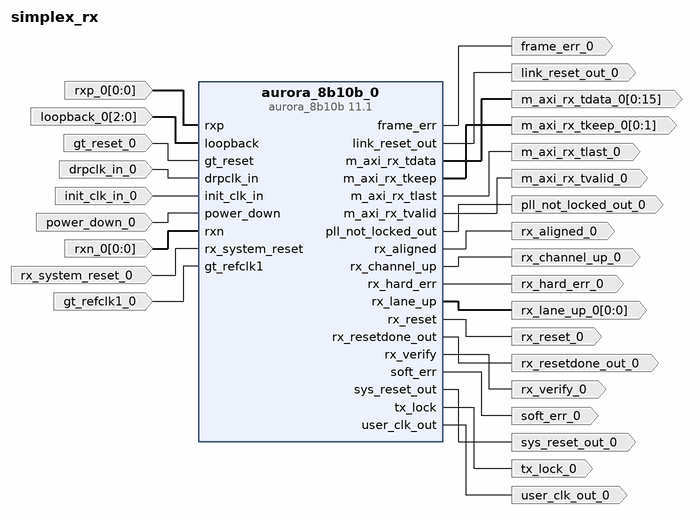
[diagram p0: block diagram of the top level]
# Vivado block design simplex_rx, xc7z045ffg900-2, Vivado 2018.3
create_bd_design simplex_rx

create_bd_port -dir I -from 0 -to 0 rxp_0
create_bd_port -dir I -from 2 -to 0 loopback_0
create_bd_port -dir I -type rst gt_reset_0
set_property -dict {CONFIG.POLARITY ACTIVE_HIGH} [get_bd_ports gt_reset_0]
create_bd_port -dir I -type clk drpclk_in_0
create_bd_port -dir I -type clk init_clk_in_0
create_bd_port -dir I -type rst power_down_0
create_bd_port -dir I -from 0 -to 0 rxn_0
create_bd_port -dir I -type rst rx_system_reset_0
set_property -dict {CONFIG.POLARITY ACTIVE_HIGH} [get_bd_ports rx_system_reset_0]
create_bd_port -dir I -type clk gt_refclk1_0
set_property -dict {CONFIG.FREQ_HZ 125000000} [get_bd_ports gt_refclk1_0]
create_bd_port -dir O -from 0 -to 1 m_axi_rx_tkeep_0
create_bd_port -dir O m_axi_rx_tlast_0
create_bd_port -dir O -from 0 -to 15 m_axi_rx_tdata_0
create_bd_port -dir O m_axi_rx_tvalid_0
create_bd_port -dir O rx_aligned_0
create_bd_port -dir O rx_reset_0
create_bd_port -dir O rx_verify_0
create_bd_port -dir O soft_err_0
create_bd_port -dir O rx_channel_up_0
create_bd_port -dir O rx_hard_err_0
create_bd_port -dir O -from 0 -to 0 rx_lane_up_0
create_bd_port -dir O rx_resetdone_out_0
create_bd_port -dir O frame_err_0
create_bd_port -dir O pll_not_locked_out_0
create_bd_port -dir O tx_lock_0
create_bd_port -dir O -type clk user_clk_out_0
set_property -dict {CONFIG.FREQ_HZ 156250000} [get_bd_ports user_clk_out_0]
create_bd_port -dir O -type rst link_reset_out_0
create_bd_port -dir O -type rst sys_reset_out_0

create_bd_cell -type ip -vlnv xilinx.com:ip:aurora_8b10b:11.1 aurora_8b10b_0
set_property -dict [list \
  CONFIG.C_DRP_IF false \
  CONFIG.Dataflow_Config RX-only_Simplex \
  CONFIG.SINGLEEND_GTREFCLK true \
  CONFIG.SINGLEEND_INITCLK true \
  CONFIG.SupportLevel 1 \
] [get_bd_cells aurora_8b10b_0]

# ---- connections ----

connect_bd_net -net rxp_0_1 [get_bd_ports rxp_0] [get_bd_pins aurora_8b10b_0/rxp]
connect_bd_net -net loopback_0_1 [get_bd_ports loopback_0] [get_bd_pins aurora_8b10b_0/loopback]
connect_bd_net -net gt_reset_0_1 [get_bd_ports gt_reset_0] [get_bd_pins aurora_8b10b_0/gt_reset]
connect_bd_net -net drpclk_in_0_1 [get_bd_ports drpclk_in_0] [get_bd_pins aurora_8b10b_0/drpclk_in]
connect_bd_net -net init_clk_in_0_1 [get_bd_ports init_clk_in_0] [get_bd_pins aurora_8b10b_0/init_clk_in]
connect_bd_net -net power_down_0_1 [get_bd_ports power_down_0] [get_bd_pins aurora_8b10b_0/power_down]
connect_bd_net -net rxn_0_1 [get_bd_ports rxn_0] [get_bd_pins aurora_8b10b_0/rxn]
connect_bd_net -net rx_system_reset_0_1 [get_bd_ports rx_system_reset_0] [get_bd_pins aurora_8b10b_0/rx_system_reset]
connect_bd_net -net gt_refclk1_0_1 [get_bd_ports gt_refclk1_0] [get_bd_pins aurora_8b10b_0/gt_refclk1]
connect_bd_net [get_bd_pins aurora_8b10b_0/m_axi_rx_tkeep] [get_bd_ports m_axi_rx_tkeep_0]
connect_bd_net [get_bd_pins aurora_8b10b_0/m_axi_rx_tlast] [get_bd_ports m_axi_rx_tlast_0]
connect_bd_net [get_bd_pins aurora_8b10b_0/m_axi_rx_tdata] [get_bd_ports m_axi_rx_tdata_0]
connect_bd_net [get_bd_pins aurora_8b10b_0/m_axi_rx_tvalid] [get_bd_ports m_axi_rx_tvalid_0]
connect_bd_net [get_bd_pins aurora_8b10b_0/rx_aligned] [get_bd_ports rx_aligned_0]
connect_bd_net [get_bd_pins aurora_8b10b_0/rx_reset] [get_bd_ports rx_reset_0]
connect_bd_net [get_bd_pins aurora_8b10b_0/rx_verify] [get_bd_ports rx_verify_0]
connect_bd_net [get_bd_pins aurora_8b10b_0/soft_err] [get_bd_ports soft_err_0]
connect_bd_net [get_bd_pins aurora_8b10b_0/rx_channel_up] [get_bd_ports rx_channel_up_0]
connect_bd_net [get_bd_pins aurora_8b10b_0/rx_hard_err] [get_bd_ports rx_hard_err_0]
connect_bd_net [get_bd_pins aurora_8b10b_0/rx_lane_up] [get_bd_ports rx_lane_up_0]
connect_bd_net [get_bd_pins aurora_8b10b_0/rx_resetdone_out] [get_bd_ports rx_resetdone_out_0]
connect_bd_net [get_bd_pins aurora_8b10b_0/frame_err] [get_bd_ports frame_err_0]
connect_bd_net [get_bd_pins aurora_8b10b_0/pll_not_locked_out] [get_bd_ports pll_not_locked_out_0]
connect_bd_net [get_bd_pins aurora_8b10b_0/tx_lock] [get_bd_ports tx_lock_0]
connect_bd_net [get_bd_pins aurora_8b10b_0/user_clk_out] [get_bd_ports user_clk_out_0]
connect_bd_net [get_bd_pins aurora_8b10b_0/link_reset_out] [get_bd_ports link_reset_out_0]
connect_bd_net [get_bd_pins aurora_8b10b_0/sys_reset_out] [get_bd_ports sys_reset_out_0]

validate_bd_design
save_bd_design
